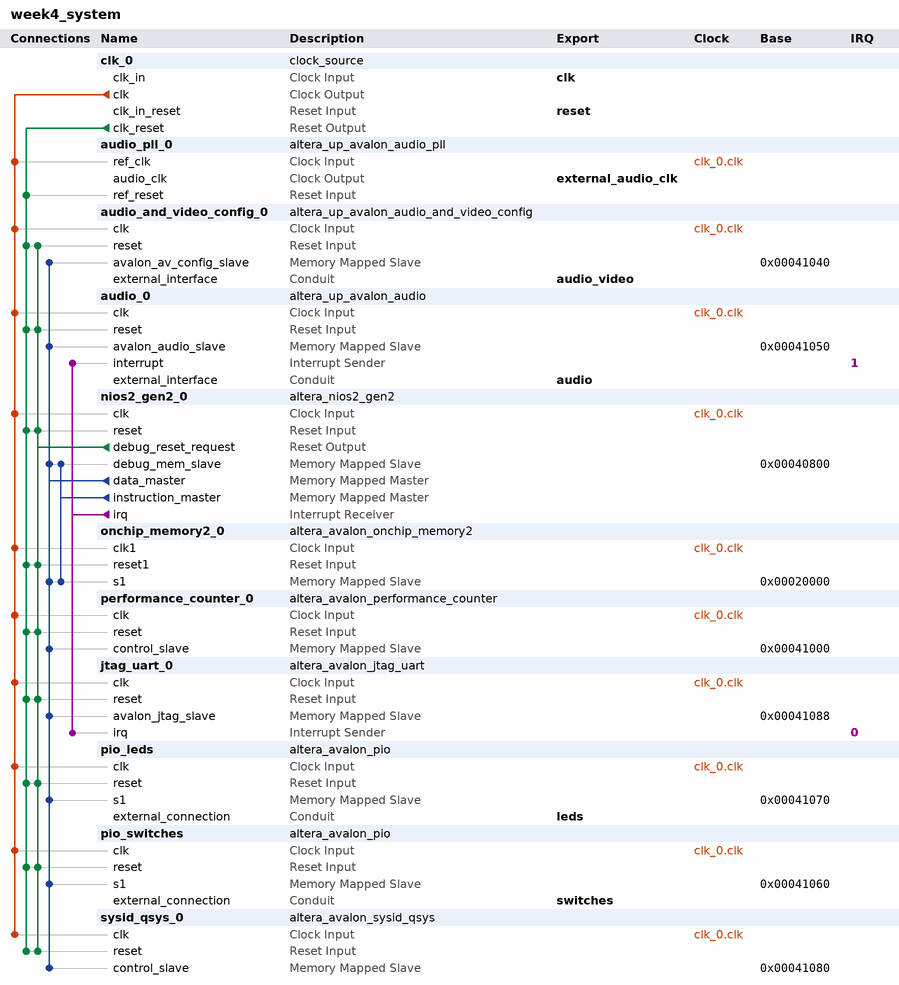
[diagram p0: system contents]
# Platform Designer (Qsys) system week4_system, Cyclone V 5CSEMA5F31C6
# Parameters at their usual value, and those the tool derives, are not listed.
package require -exact qsys 18.1
create_system week4_system
set_project_property DEVICE_FAMILY {Cyclone V}
set_project_property DEVICE 5CSEMA5F31C6

add_instance clk_0 clock_source 18.1
set_instance_parameter_value clk_0 clockFrequency 50000000

add_instance audio_pll_0 altera_up_avalon_audio_pll 18.0
set_instance_parameter_value audio_pll_0 gui_refclk 50.0

add_instance audio_and_video_config_0 altera_up_avalon_audio_and_video_config 18.0
set_instance_parameter_value audio_and_video_config_0 audio_in {Line In to ADC}
set_instance_parameter_value audio_and_video_config_0 bit_length 16
set_instance_parameter_value audio_and_video_config_0 board DE10-Standard
set_instance_parameter_value audio_and_video_config_0 line_in_bypass false
set_instance_parameter_value audio_and_video_config_0 mic_bypass true
set_instance_parameter_value audio_and_video_config_0 sampling_rate {48 kHz}

add_instance audio_0 altera_up_avalon_audio 18.0
set_instance_parameter_value audio_0 audio_in true
set_instance_parameter_value audio_0 avalon_bus_type {Memory Mapped}
set_instance_parameter_value audio_0 dw 16

add_instance nios2_gen2_0 altera_nios2_gen2 18.1
set_instance_parameter_value nios2_gen2_0 dcache_size 2048
set_instance_parameter_value nios2_gen2_0 exceptionSlave onchip_memory2_0.s1
set_instance_parameter_value nios2_gen2_0 icache_size 4096
set_instance_parameter_value nios2_gen2_0 impl Fast
set_instance_parameter_value nios2_gen2_0 resetSlave onchip_memory2_0.s1

add_instance onchip_memory2_0 altera_avalon_onchip_memory2 18.1
set_instance_parameter_value onchip_memory2_0 dataWidth 32
set_instance_parameter_value onchip_memory2_0 dualPort false
set_instance_parameter_value onchip_memory2_0 initMemContent true
set_instance_parameter_value onchip_memory2_0 initializationFileName onchip_mem.hex
set_instance_parameter_value onchip_memory2_0 memorySize 131072

add_instance performance_counter_0 altera_avalon_performance_counter 18.1
set_instance_parameter_value performance_counter_0 numberOfSections 3

add_instance jtag_uart_0 altera_avalon_jtag_uart 18.1
set_instance_parameter_value jtag_uart_0 simInteractiveOptions NO_INTERACTIVE_WINDOWS

add_instance pio_leds altera_avalon_pio 18.1
set_instance_parameter_value pio_leds direction Output
set_instance_parameter_value pio_leds width 10

add_instance pio_switches altera_avalon_pio 18.1
set_instance_parameter_value pio_switches direction Input
set_instance_parameter_value pio_switches width 10

add_instance sysid_qsys_0 altera_avalon_sysid_qsys 18.1
set_instance_parameter_value sysid_qsys_0 id 0

# connections
add_connection clk_0.clk audio_0.clk clock
add_connection clk_0.clk audio_and_video_config_0.clk clock
add_connection clk_0.clk audio_pll_0.ref_clk clock
add_connection clk_0.clk jtag_uart_0.clk clock
add_connection clk_0.clk nios2_gen2_0.clk clock
add_connection clk_0.clk onchip_memory2_0.clk1 clock
add_connection clk_0.clk performance_counter_0.clk clock
add_connection clk_0.clk pio_leds.clk clock
add_connection clk_0.clk pio_switches.clk clock
add_connection clk_0.clk sysid_qsys_0.clk clock
add_connection clk_0.clk_reset audio_0.reset reset
add_connection clk_0.clk_reset audio_and_video_config_0.reset reset
add_connection clk_0.clk_reset audio_pll_0.ref_reset reset
add_connection clk_0.clk_reset jtag_uart_0.reset reset
add_connection clk_0.clk_reset nios2_gen2_0.reset reset
add_connection clk_0.clk_reset onchip_memory2_0.reset1 reset
add_connection clk_0.clk_reset performance_counter_0.reset reset
add_connection clk_0.clk_reset pio_leds.reset reset
add_connection clk_0.clk_reset pio_switches.reset reset
add_connection clk_0.clk_reset sysid_qsys_0.reset reset
add_connection nios2_gen2_0.debug_reset_request audio_0.reset reset
add_connection nios2_gen2_0.debug_reset_request audio_and_video_config_0.reset reset
add_connection nios2_gen2_0.debug_reset_request jtag_uart_0.reset reset
add_connection nios2_gen2_0.debug_reset_request nios2_gen2_0.reset reset
add_connection nios2_gen2_0.debug_reset_request onchip_memory2_0.reset1 reset
add_connection nios2_gen2_0.debug_reset_request performance_counter_0.reset reset
add_connection nios2_gen2_0.debug_reset_request pio_leds.reset reset
add_connection nios2_gen2_0.debug_reset_request pio_switches.reset reset
add_connection nios2_gen2_0.debug_reset_request sysid_qsys_0.reset reset
add_connection nios2_gen2_0.data_master audio_0.avalon_audio_slave avalon
set_connection_parameter_value nios2_gen2_0.data_master/audio_0.avalon_audio_slave baseAddress 0x00041050
add_connection nios2_gen2_0.data_master audio_and_video_config_0.avalon_av_config_slave avalon
set_connection_parameter_value nios2_gen2_0.data_master/audio_and_video_config_0.avalon_av_config_slave baseAddress 0x00041040
add_connection nios2_gen2_0.data_master jtag_uart_0.avalon_jtag_slave avalon
set_connection_parameter_value nios2_gen2_0.data_master/jtag_uart_0.avalon_jtag_slave baseAddress 0x00041088
add_connection nios2_gen2_0.data_master nios2_gen2_0.debug_mem_slave avalon
set_connection_parameter_value nios2_gen2_0.data_master/nios2_gen2_0.debug_mem_slave baseAddress 0x00040800
add_connection nios2_gen2_0.data_master onchip_memory2_0.s1 avalon
set_connection_parameter_value nios2_gen2_0.data_master/onchip_memory2_0.s1 baseAddress 0x00020000
add_connection nios2_gen2_0.data_master performance_counter_0.control_slave avalon
set_connection_parameter_value nios2_gen2_0.data_master/performance_counter_0.control_slave baseAddress 0x00041000
add_connection nios2_gen2_0.data_master pio_leds.s1 avalon
set_connection_parameter_value nios2_gen2_0.data_master/pio_leds.s1 baseAddress 0x00041070
add_connection nios2_gen2_0.data_master pio_switches.s1 avalon
set_connection_parameter_value nios2_gen2_0.data_master/pio_switches.s1 baseAddress 0x00041060
add_connection nios2_gen2_0.data_master sysid_qsys_0.control_slave avalon
set_connection_parameter_value nios2_gen2_0.data_master/sysid_qsys_0.control_slave baseAddress 0x00041080
add_connection nios2_gen2_0.instruction_master nios2_gen2_0.debug_mem_slave avalon
set_connection_parameter_value nios2_gen2_0.instruction_master/nios2_gen2_0.debug_mem_slave baseAddress 0x00040800
add_connection nios2_gen2_0.instruction_master onchip_memory2_0.s1 avalon
set_connection_parameter_value nios2_gen2_0.instruction_master/onchip_memory2_0.s1 baseAddress 0x00020000
add_connection nios2_gen2_0.irq audio_0.interrupt interrupt
set_connection_parameter_value nios2_gen2_0.irq/audio_0.interrupt irqNumber 1
add_connection nios2_gen2_0.irq jtag_uart_0.irq interrupt
set_connection_parameter_value nios2_gen2_0.irq/jtag_uart_0.irq irqNumber 0

# exported interfaces
add_interface audio conduit end
set_interface_property audio EXPORT_OF audio_0.external_interface
add_interface audio_video conduit end
set_interface_property audio_video EXPORT_OF audio_and_video_config_0.external_interface
add_interface clk clock sink
set_interface_property clk EXPORT_OF clk_0.clk_in
add_interface external_audio_clk clock source
set_interface_property external_audio_clk EXPORT_OF audio_pll_0.audio_clk
add_interface leds conduit end
set_interface_property leds EXPORT_OF pio_leds.external_connection
add_interface reset reset sink
set_interface_property reset EXPORT_OF clk_0.clk_in_reset
add_interface switches conduit end
set_interface_property switches EXPORT_OF pio_switches.external_connection

set_interconnect_requirement {$system} qsys_mm.clockCrossingAdapter HANDSHAKE
set_interconnect_requirement {$system} qsys_mm.enableEccProtection FALSE
set_interconnect_requirement {$system} qsys_mm.insertDefaultSlave FALSE
set_interconnect_requirement {$system} qsys_mm.maxAdditionalLatency 1

save_system week4_system.qsys
